# EAGLE design MODUL_GNU-PI_BRIDGE_V1001 (EAGLE 6.4)
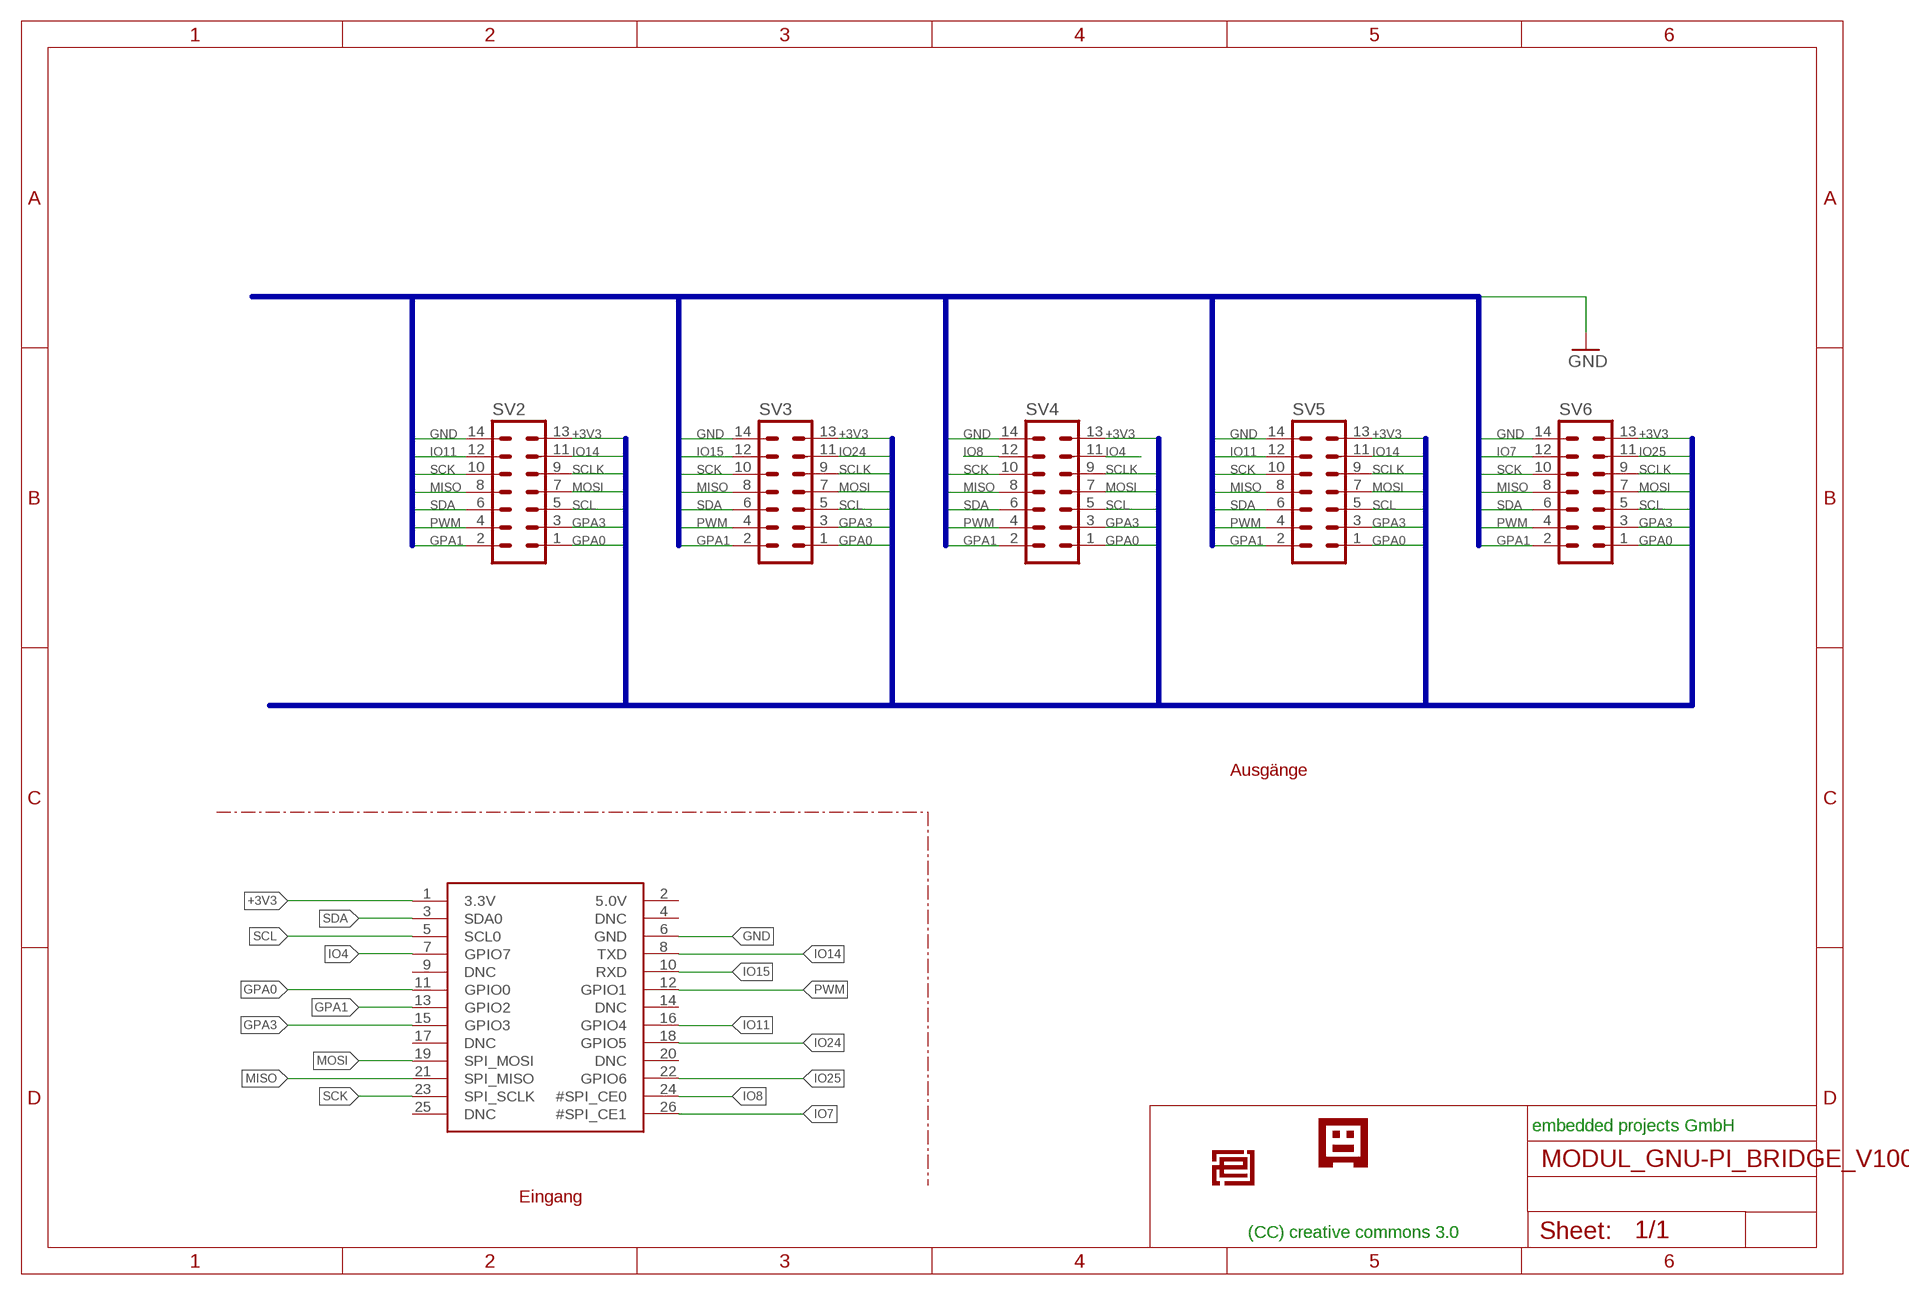
[diagram p0: schematic, sheet 1]

## Parts
SV2  ML14  [ML14]
SV3  ML14  [ML14]
SV4  ML14  [ML14]
SV5  ML14  [ML14]
SV6  ML14  [ML14]
U$1  RASPBERRYPI_BB  [RASBERRYPI_SHIELD]
U$2  EPLOGOSIEB  [EPLOGOSIEBDRUCK]
U$3  GNUBLINLOGOSIEB  [GNUSIEBDRUCK]

## Nets
+3V3: SV2.13 SV3.13 SV4.13 SV5.13 SV6.13 U$1.1(3.3V)
GND: SV2.14 SV3.14 SV4.14 SV5.14 SV6.14 U$1.6(GND)
GPA0: SV2.1 SV3.1 SV4.1 SV5.1 SV6.1 U$1.11(GPIO0)
GPA1: SV2.2 SV3.2 SV4.2 SV5.2 SV6.2 U$1.13(GPIO2)
GPA3: SV2.3 SV3.3 SV4.3 SV5.3 SV6.3 U$1.15(GPIO3)
IO4: SV4.11 U$1.7(GPIO7)
IO7: SV6.12 U$1.26(#SPI_CE1)
IO8: SV4.12 U$1.24(#SPI_CE0)
IO11: SV2.12 SV5.12 U$1.16(GPIO4)
IO14: SV2.11 SV5.11 U$1.8(TXD)
IO15: SV3.12 U$1.10(RXD)
IO24: SV3.11 U$1.18(GPIO5)
IO25: SV6.11 U$1.22(GPIO6)
MISO: SV2.8 SV3.8 SV4.8 SV5.8 SV6.8 U$1.21(SPI_MISO)
MOSI: SV2.7 SV3.7 SV4.7 SV5.7 SV6.7 U$1.19(SPI_MOSI)
PWM: SV2.4 SV3.4 SV4.4 SV5.4 SV6.4 U$1.12(GPIO1)
SCK: SV2.10 SV3.10 SV4.10 SV5.10 SV6.10 U$1.23(SPI_SCLK)
SCL: SV2.5 SV3.5 SV4.5 SV5.5 SV6.5 U$1.5(SCL0)
SCLK: SV2.9 SV3.9 SV4.9 SV5.9 SV6.9
SDA: SV2.6 SV3.6 SV4.6 SV5.6 SV6.6 U$1.3(SDA0)
Unconnected: U$1.2(5.0V) U$1.4(DNC) U$1.9(DNC) U$1.14(DNC) U$1.17(DNC) U$1.20(DNC) U$1.25(DNC)

## Buses
B$1:GPA1,PWM,SDA,MISO,SCK,IO4,IO7,IO11,IO15,GND
B$2:GPA0,GPA3,SCL,MOSI,SCLK,IO8,IO14,IO24,IO25,+3V3

## Notes on the sheet
- Ausgänge
- embedded projects GmbH
- Eingang
- (CC) creative commons 3.0

## Library data of the parts
SV2-SV6 = con-ml:ML14: HARTING
U$1 = microbuilder:RASPBERRYPI_B
U$2 = EmbeddedProjectsLogos2:EPLOGO
U$3 = EmbeddedProjectsLogos2:GNUBLINLOGO

## Board
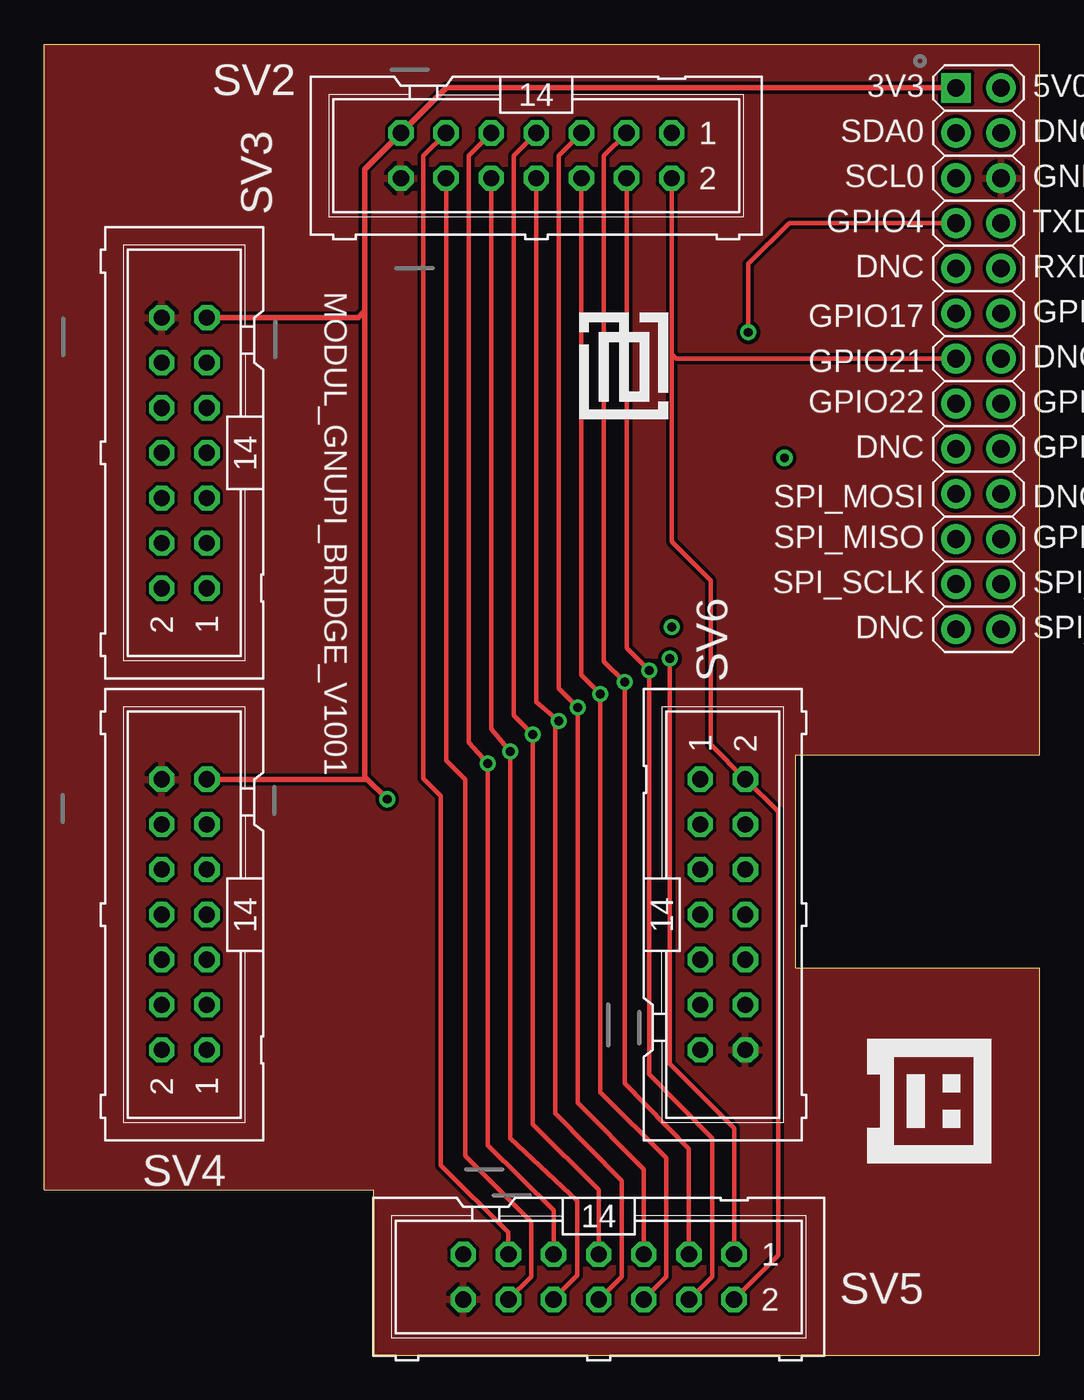
[diagram p1: board, top side]
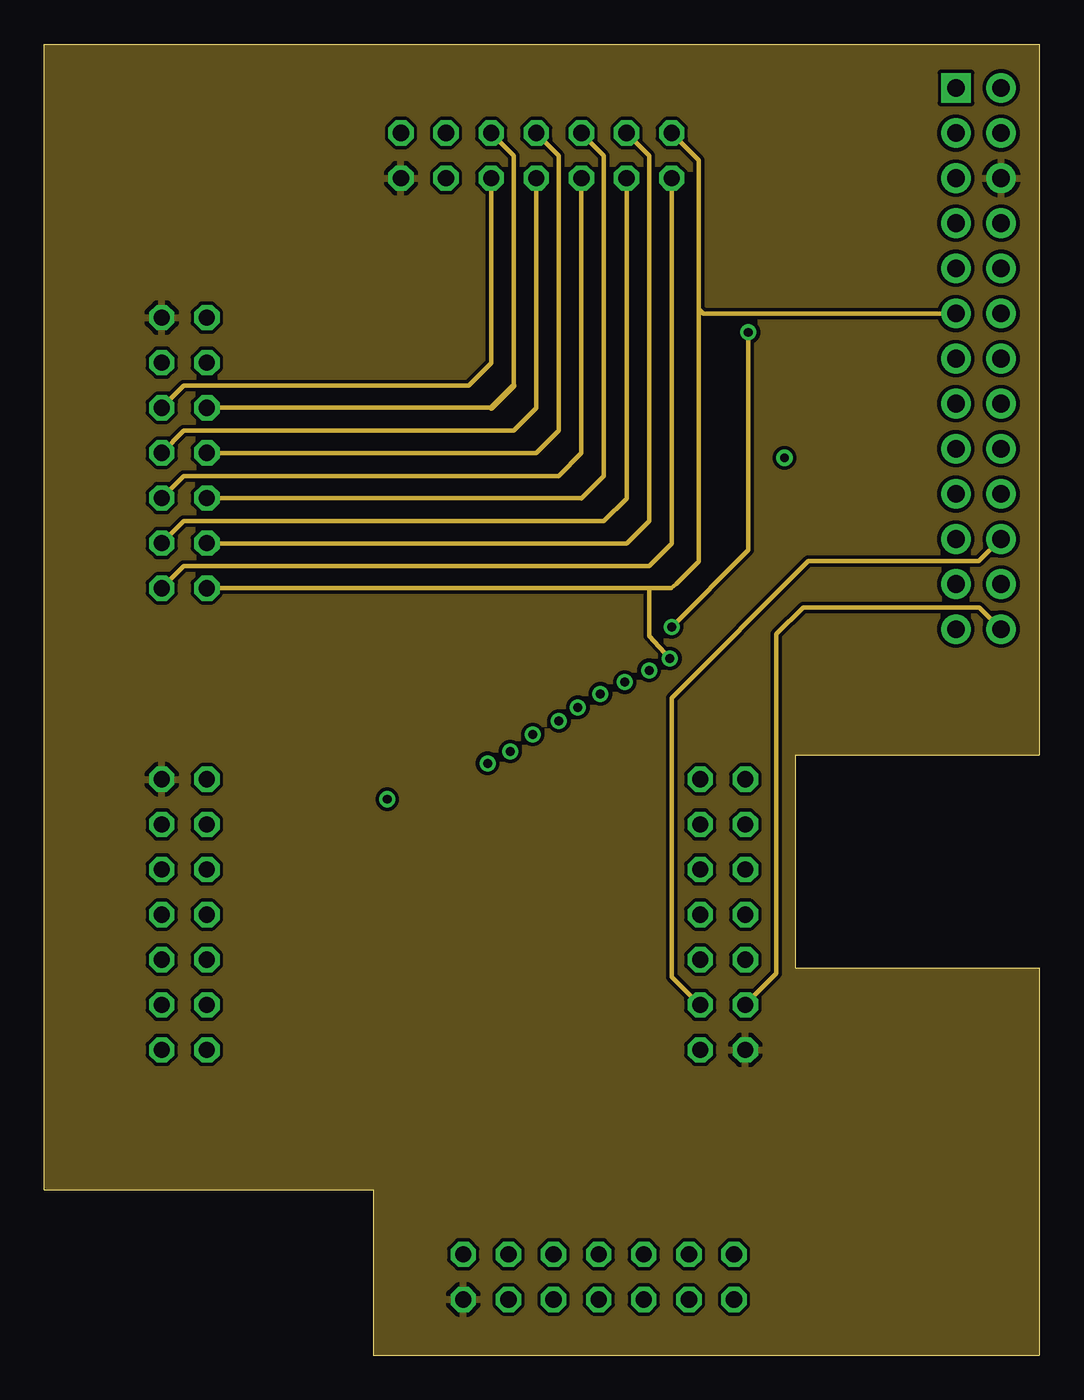
[diagram p2: board, inner layer Route2]
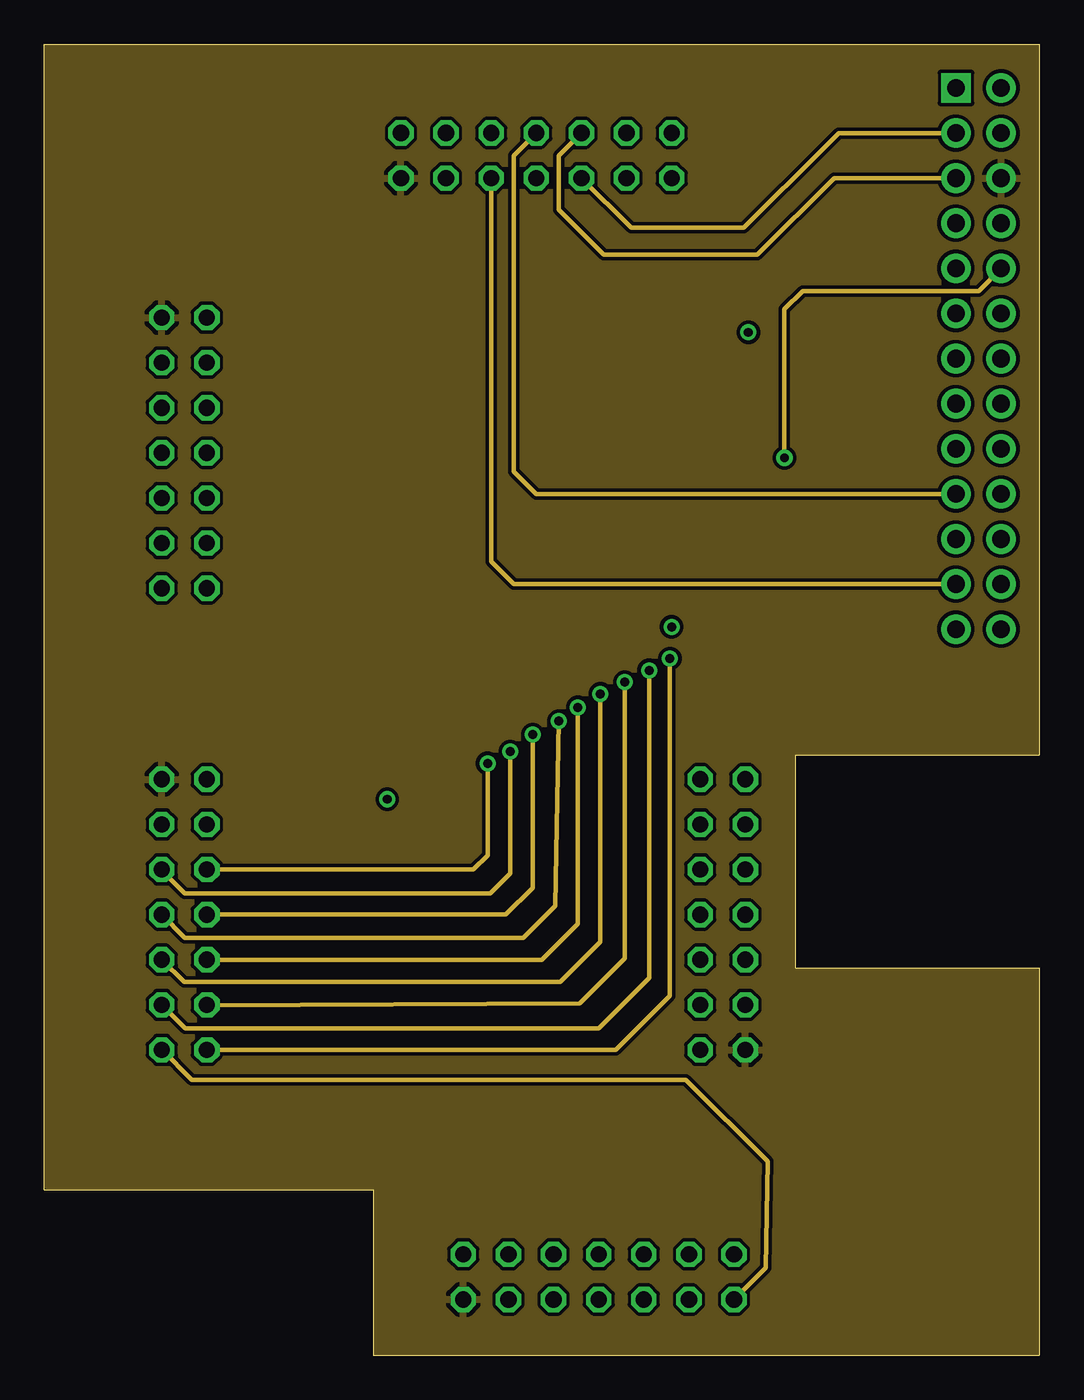
[diagram p3: board, inner layer Route15]
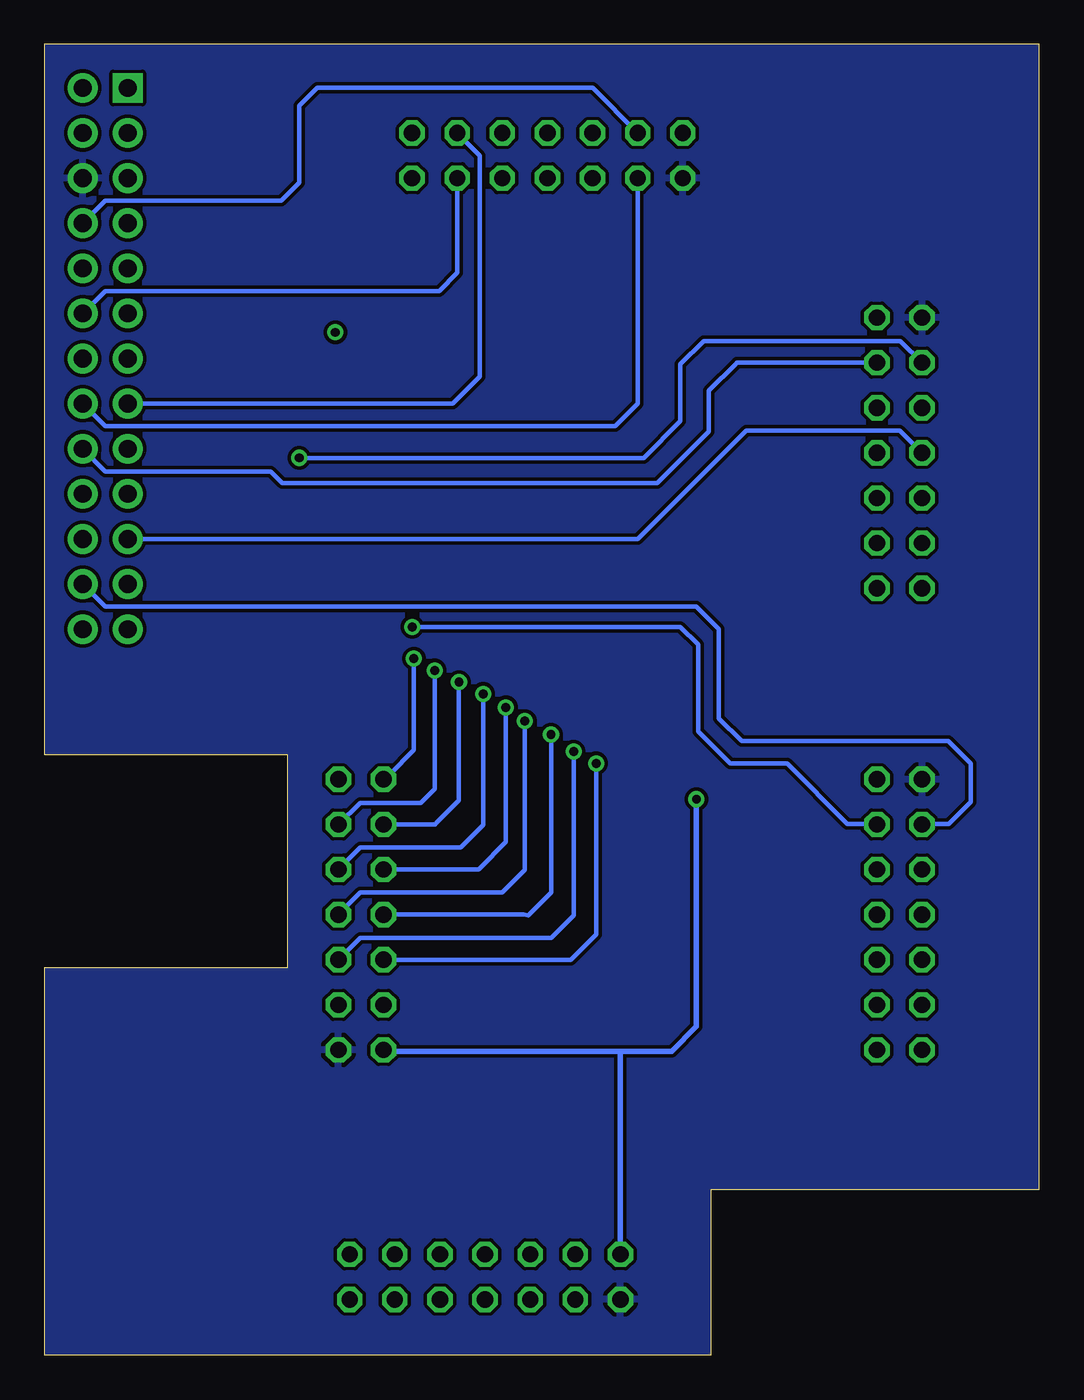
[diagram p4: board, bottom side, seen from below]

Size 56 x 73.8 mm. Coordinates in mm from the lower left corner, seen from the top.
Outline: 18.5,0 44.8,0 56,0 56,21.8 55.9,21.8 42.3,21.8 42.3,33.8 56,33.8 56,73.8 0,73.8 0,9.3 18.5,9.3 18.5,0
Copper layers (1*2+15*16): Top 0.035mm / dielectric 1.5mm / Route2 0.035mm / dielectric 0.15mm / Route15 0.035mm / dielectric 0.2mm / Bottom 0.035mm
Design rules "default *": minimum track width 8mil, minimum drill 15mil, track to track 8mil, track to pad 8mil, pad to pad 8mil, via to via 8mil, smd to smd 8mil, copper to edge 1mil, drill to drill 8mil, minimum pad ring 10mil, minimum via ring 8mil, stop-mask expansion 2mil, vias tented up to drill 40mil, thermal gap 10mil

### Footprints (pad centres in the part's own frame; a part is rotated, then mirrored left to right if it is on the bottom)
ML14 = drill 0.914 octagon: 1 -7.62,-1.27; 2 -7.62,1.27; 3 -5.08,-1.27; 4 -5.08,1.27; 5 -2.54,-1.27; 6 -2.54,1.27; 7 0,-1.27; 8 0,1.27; 9 2.54,-1.27; 10 2.54,1.27; 11 5.08,-1.27; 12 5.08,1.27; 13 7.62,-1.27; 14 7.62,1.27
RASBERRYPI_SHIELD = drill 1 pad 1.676 square: 1 51.308,82.55 | drill 1 pad 1.676: 2 53.848,82.55; 3 51.308,80.01; 4 53.848,80.01; 5 51.308,77.47; 6 53.848,77.47; 7 51.308,74.93; 8 53.848,74.93; 9 51.308,72.39; 10 53.848,72.39; 11 51.308,69.85; 12 53.848,69.85; 13 51.308,67.31; 14 53.848,67.31; 15 51.308,64.77; 16 53.848,64.77; 17 51.308,62.23; 18 53.848,62.23; 19 51.308,59.69; 20 53.848,59.69; 21 51.308,57.15; 22 53.848,57.15; 23 51.308,54.61; 24 53.848,54.61; 25 51.308,52.07; 26 53.848,52.07

### Placement (x,y rotation side)
SV2  27.69,67.54 180 top
SV3  7.87,50.8 90 top
SV4  7.87,24.8 90 top
SV5  31.2,4.4 180 top
SV6  38.18,24.8 270 top
U$1  0,-11.2 0 top
U$2  30.1,58.7 270 top
U$3  46.3,17.8 270 top

### Tracks (layer width: path | path; a pad name or v marks a point on that pad's centre or on a via)
+3V3  (via drill 0.5)
  Top 0.305: 18.03,58.8 18.03,66.78 SV2.13 22.61,71.35 U$1.1 | 18.03,58.8 18.03,50.52 18.03,32.52 18.08,32.48 | SV4.13 18.02,32.42 18.08,32.48 | 18.08,32.48 18.12,32.48 v19.3,31.3 | SV3.13 17.65,58.42 18.03,58.8
  Bottom 0.305: v19.3,31.3 19.3,18.5 20.7,17.1 23.6,17.1 | 23.6,17.1 36.83,17.1 SV6.13 | SV5.13 23.58,17.08 23.6,17.1
GND
  pour Route15: -1.02,74.65 57.15,74.65 57.2,33.4 57.2,33.3 42.4,33.3 42.3,22.2 57.1,22.2 57,-0.32 57.05,-0.42 38.51,-0.17 38.51,-0.37 17.98,-0.27 17.98,9.08 -1.32,9.18
  pour Top: -0.76,74.4 56.39,74.4 57.1,33.3 42.4,33.2 42.3,22.2 57.1,22.2 57.1,-0.32 38.51,-0.32 38.41,-0.32 18.18,-0.22 18.08,8.88 -1.37,9.08
  pour Bottom: -0.76,74.4 57.15,74.4 57.2,33.3 42.3,33.3 42.3,22.4 57.2,22.4 57.2,0.18 57.15,-0.32 38.81,-0.37 38.71,-0.37 18.08,-0.27 18.08,8.98 -1.36,9.08
  pour Route2: -0.51,74.4 56.9,74.4 57.1,33.3 42.4,33.3 42.4,22.4 57.2,22.4 56.9,-0.42 38.31,-0.42 38.51,-0.32 18.03,-0.32 18.43,9.38 -1.31,9.38
GPA0  (via drill 0.5)
  Top 0.254: SV5.1 38.82,12.78 35.2,16.4 35.2,39.11 v35.21,39.22
  Route2 0.254: 36.83,58.9 36.83,44.68 35.56,43.41 35.28,43.18 34.04,43.18 | 36.83,58.9 36.83,67.29 SV2.1 | v35.21,39.22 34.04,40.49 34.04,43.18 | U$1.11 37.08,58.65 36.83,58.9 | SV3.1 34.04,43.18
  Route15 0.254: v35.21,39.22 35.21,20.22 32.17,17.18 SV4.1
  Bottom 0.254: v35.21,39.22 35.21,34.06 36.58,32.69 36.85,32.42 SV6.1
GPA1
  Top 0.254: SV2.2 35.31,56.36 | 35.31,56.36 35.31,45.85 35.31,45.79 37.5,43.6 37.5,37.4 37.5,34.37 SV6.2 39.48,32.42 41.3,30.6 41.3,5.61 SV5.2 | U$1.13 35.56,56.11 35.31,56.36
  Route2 0.254: SV2.2 35.31,45.7 34.04,44.43 7.85,44.43 SV3.2
  Route15 0.254: SV4.2 6.62,17.18 8.3,15.5 36.1,15.5 40.7,10.9 40.6,4.91 SV5.2
GPA3  (via drill 0.5)
  Top 0.254: SV2.3 31.5,67.54 31.5,39.06 v32.67,37.89 32.67,37.83 32.67,15.3 36.28,11.62 SV5.3
  Route2 0.254: SV2.3 34.04,67.54 34.04,46.97 32.77,45.7 9.17,45.7 SV3.3
  Route15 0.254: v32.67,37.89 32.67,22.35 30.12,19.8 9.16,19.7 SV4.3
  Bottom 0.254: v32.67,37.89 32.67,31.22 33.94,29.95 34.01,29.88 SV6.3 | U$1.15 33.02,53.57 31.5,55.09 31.5,67.54 SV2.3
IO4  (via drill 0.5)
  Top 0.254: v39.62,57.59 39.62,61.44 41.91,63.73 U$1.7
  Route2 0.254: v39.62,57.59 39.62,45.32 v35.3,41
  Bottom 0.254: v35.3,41 20.2,41 19.2,40 19.2,35.1 17.4,33.3 14.2,33.3 10.8,29.9 9.16,29.9 SV4.11
IO7
  Route2 0.254: SV6.12 39.45,19.75 41.2,21.5 41.2,40.6 42.7,42.1 52.62,42.1 U$1.26
IO8
  Bottom 0.254: U$1.24 52.58,42.14 19.3,42.14 18.03,40.87 18.03,35.86 16.76,34.59 5.13,34.59 3.99,33.44 | 3.99,33.44 3.86,33.32 | 3.86,33.32 3.99,33.44 | 3.86,33.32 3.86,31.14 5.1,29.9 6.58,29.9 SV4.12
IO11
  Top 0.254: SV2.12 22.61,33.48 23.68,32.41 23.68,11.22 27.4,7.5 27.4,4.41 SV5.12
  Bottom 0.254: U$1.16 52.58,52.3 23.88,52.3 22.61,53.57 SV2.12
IO14
  Top 0.254: SV2.11 21.34,67.54 21.34,32.46 22.31,31.49 22.31,10.69 26.1,6.9 26.1,5.69 SV5.11
  Bottom 0.254: U$1.8 52.58,65 42.67,65 41.66,66.02 41.66,70.33 40.64,71.35 25.15,71.35 SV2.11
IO15  (via drill 0.5)
  Route15 0.254: v41.66,50.52 41.66,58.9 42.67,59.92 52.58,59.92 U$1.10
  Bottom 0.254: v41.66,50.52 22.29,50.52 22.28,50.52 20.2,52.6 20.2,55.8 18.9,57.1 7.82,57.1 SV3.12
IO24
  Bottom 0.254: U$1.18 52.58,49.76 43.26,49.76 42.6,49.1 21.5,49.1 18.6,52 18.6,54.3 17.1,55.8 17.02,55.88 SV3.11
IO25
  Route2 0.254: SV6.11 36.88,19.72 35.3,21.3 35.3,37 43,44.7 52.6,44.7 U$1.22
MISO  (via drill 0.5)
  Top 0.254: SV2.8 27.69,36.78 v28.96,35.71 28.76,35.65 28.76,13.6 32.5,9.8 32.5,4.4 31.23,3.13 SV5.8
  Route2 0.254: SV2.8 27.69,53.32 26.42,52.05 7.85,52.05 SV3.8
  Route15 0.254: v28.96,35.71 28.76,25.3 26.96,23.5 26.8,23.5 7.9,23.5 SV4.8
  Bottom 0.254: v28.96,35.71 28.96,27.31 30.23,26.04 38.11,26.04 38.21,26.04 SV6.8 | U$1.21 28.19,45.95 22.6,45.95 16.5,52.05 7.85,52.05 SV3.8
MOSI  (via drill 0.5)
  Top 0.254: SV2.7 26.42,67.54 26.42,36.02 27.5,34.93 | 27.5,34.93 v27.49,34.95 27.5,34.93 | SV5.7 31.2,9.3 27.5,13 27.5,34.93
  Route2 0.254: SV2.7 28.96,67.54 28.96,52.05 27.69,50.78 27.66,50.8 SV3.7
  Route15 0.254: v27.49,34.95 27.49,26.31 25.97,24.8 SV4.7 | U$1.19 27.69,48.49 26.42,49.76 26.42,67.54 SV2.7
  Bottom 0.254: v27.49,34.95 27.49,26.04 28.76,24.77 29.03,24.8 SV6.7
PWM  (via drill 0.5)
  Top 0.254: SV2.4 32.77,39.83 v34.04,38.56 34.04,38.52 34.04,15.8 37.6,12.2 37.6,4.4 36.33,3.13 SV5.4
  Route2 0.254: SV2.4 32.77,48.24 31.5,46.97 7.85,46.97 SV3.4
  Route15 0.254: v34.04,38.56 34.04,38.05 34.04,21.23 31.2,18.4 7.92,18.4 SV4.4
  Bottom 0.254: v34.04,38.56 34.04,31.89 34.83,31.1 38.1,31.1 38.23,31.1 SV6.4 | U$1.12 52.58,59.92 33.78,59.92 32.77,60.94 SV2.4
SCK  (via drill 0.5)
  Top 0.254: SV2.10 25.15,35.25 v26.22,33.98 26.22,33.9 26.22,12.2 30,8.7 30,4.5 28.66,3.16 SV5.10
  Route2 0.254: SV2.10 25.15,55.86 23.88,54.59 7.85,54.59 SV3.10
  Route15 0.254: v26.22,33.98 26.22,27.13 25.09,26 | U$1.23 26.42,43.41 25.15,44.68 SV2.10 | SV4.10 6.6,27.3 7.9,26 25.09,26 | 25.09,26 25.1,26 25.09,26
  Bottom 0.254: v26.22,33.98 26.22,24.77 27.49,23.5 38.1,23.5 38.21,23.5 SV6.10
SCL  (via drill 0.5)
  Top 0.254: SV2.5 28.96,67.54 28.96,37.54 v30.03,36.47 | SV5.5 33.74,10.46 30.03,14.2 30.03,36.44 | 30.03,36.44 v30.03,36.47 | v30.03,36.47 30.03,36.44 | 30.03,36.44 v30.03,36.47
  Route2 0.254: 30.23,48.24 30.61,48.62 | 30.61,48.62 31.5,49.51 31.5,67.54 SV2.5 | SV3.5 30.25,48.26 30.61,48.62
  Route15 0.254: v30.03,36.47 30.03,24.28 28.01,22.26 SV4.5 | U$1.5 44.45,66.27 40.13,61.95 31.5,61.95 28.96,64.49 28.96,67.54 SV2.5
  Bottom 0.254: v30.03,36.47 30.03,28.88 31.5,27.41 31.57,27.34 SV6.5
SCLK  (via drill 0.5)
  Top 0.254: SV2.9 23.88,67.54 23.88,34.49 v24.95,33.32 24.95,33.28 24.95,11.8 28.66,8.14 SV5.9
  Route2 0.254: 26.42,54.59 26.42,67.54 SV2.9 | SV3.9 25.12,53.34 25.15,53.32
  Route2 0.305: 25.15,53.32 26.42,54.59
  Route15 0.254: v24.95,33.32 24.95,28.14 24.14,27.34 SV4.9
  Bottom 0.254: v24.95,33.32 24.95,23.7 26.22,22.43 26.39,22.26 SV6.9
SDA  (via drill 0.5)
  Top 0.254: SV2.6 30.23,38.3 v31.3,37.23 v31.3,37.24 31.3,14.8 35,11.1 35,4.4 SV5.6
  Route2 0.254: SV2.6 30.23,50.78 28.96,49.51 7.85,49.51 SV3.6
  Route15 0.254: v31.3,37.23 31.3,23.26 29.03,21 7.86,21 SV4.6 | U$1.3 44.7,68.81 42.67,66.78 40.64,64.75 39.37,63.48 33.02,63.48 SV2.6
  Bottom 0.254: v31.3,37.23 31.3,29.85 32.57,28.58 38.21,28.58 SV6.6

### Text on the board
tNames: MODUL_GNUPI_BRIDGE_V1001
tDocu: +3V3, IO14, SCLK, MOSI, SCL, GPA3, GPA0 | GND, IO15, SCK, MISO, SDA, PWM, GPA1 | +3V3, IO24, SCLK, MOSI, SCL, GPA3, GPA0 | GND, IO11, SCK, MISO, SDA, PWM, GPA1 | www.gnublin.org | Module-GnuPi | +3V3, IO4, SCLK, MOSI, SCL, GPA3, GPA0 | GND, IO8, SCK, MISO, SDA, PWM, GPA1 | /dev/spidev-0.0 | /dev/spidev-0.1 | GND, IO7, SCK, MISO, SDA, PWM, GPA1 | +3V3, IO25, SCLK, MOSI, SCL, GPA3, GPA0 | +3V3, IO14, SCLK, MOSI, SCL, GPA3, GPA0 | GND, IO11, SCK, MISO, SDA, PWM, GPA1